# EAGLE design GamePad (EAGLE 9.3.2)
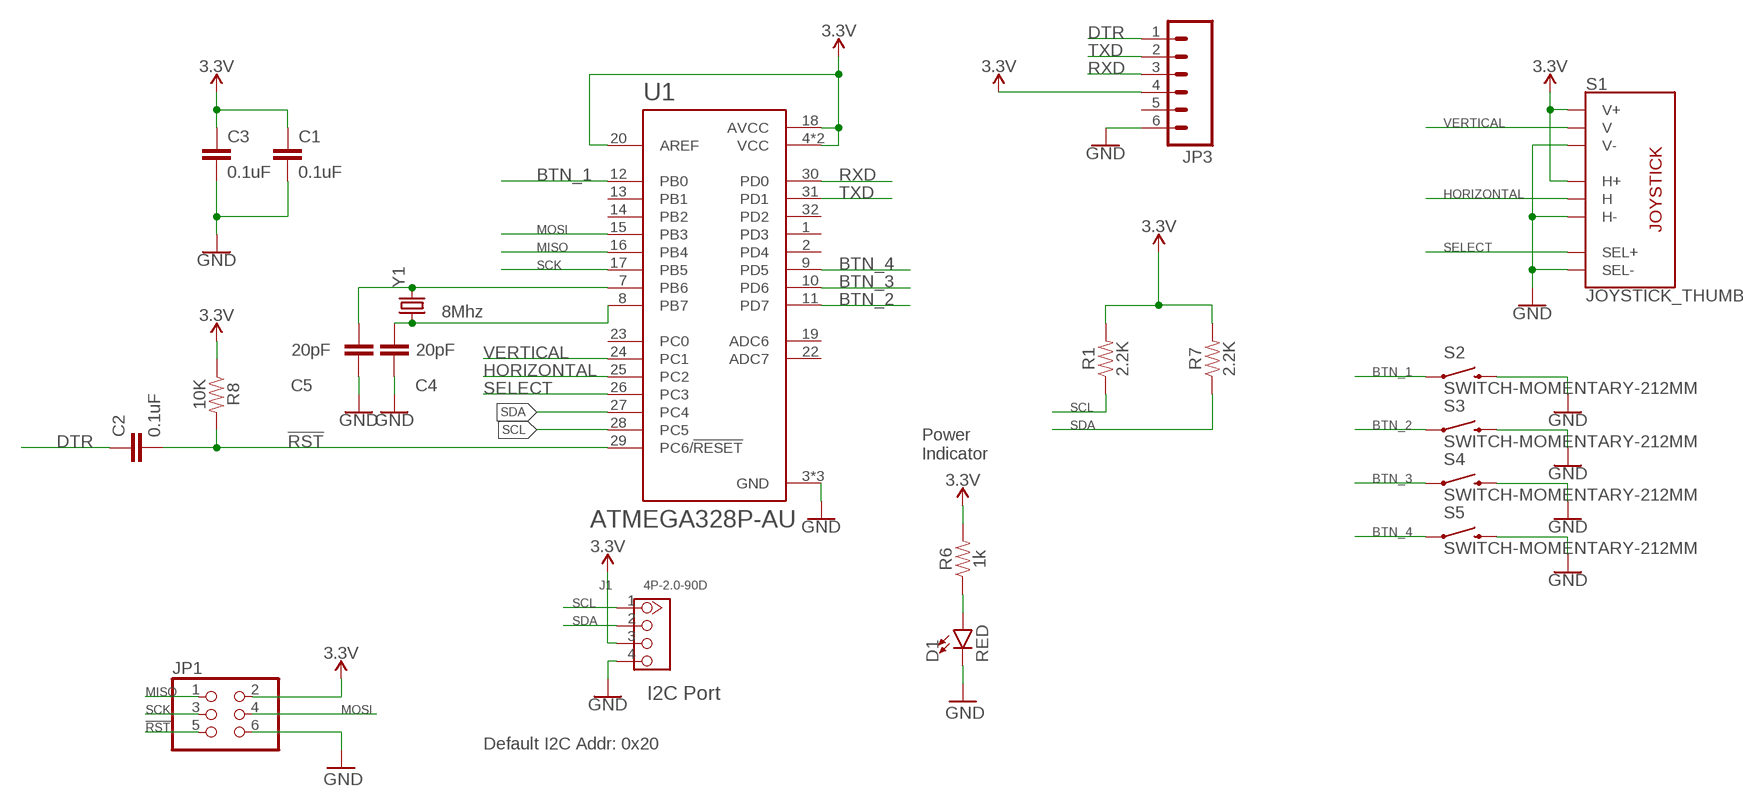
[diagram p0: schematic, sheet 1]

## Parts
C1  0.1uF  CAP0603-CAP  [0603-CAP]
C2  0.1uF  CAP0603-CAP  [0603-CAP]
C3  0.1uF  CAP0603-CAP  [0603-CAP]
C4  20pF  CAP0603-CAP  [0603-CAP]
C5  20pF  CAP0603-CAP  [0603-CAP]
D1  RED  LED-RED0603  [LED-0603]
J1  4P-2.0-90D  GROVE-CONNECTOR-DIP-90D(4P-2.0)  [HW4-2.0-90D]
JP1  PINHD-2X3  [2X03]
JP3  M06LOCK  [1X06_LOCK]
R1  2.2K  4.7KOHM-0603-1/10W-1%  [0603]
R6  1k  1KOHM-0603-1/10W-1%  [0603]
R7  2.2K  4.7KOHM-0603-1/10W-1%  [0603]
R8  10K  330OHM-0603-1/10W-1%  [0603]
S1  JOYSTICK_THUMB  [JOYSTICK]
S2  SWITCH-MOMENTARY-212MM  [TACTILE-PTH-12MM]
S3  SWITCH-MOMENTARY-212MM  [TACTILE-PTH-12MM]
S4  SWITCH-MOMENTARY-212MM  [TACTILE-PTH-12MM]
S5  SWITCH-MOMENTARY-212MM  [TACTILE-PTH-12MM]
U1  ATMEGA328P-AU  [QFP80P900X900X120-32N]
Y1  8Mhz  CRYSTALSMD  [HC49UP]

## Nets
3.3V: C1.1 C3.1 J1.3 JP1.2 JP3.4 R1.2 R6.2 R7.2 R8.1 S1.H1(H+) S1.V1(V+) U1.4(VCC) U1.6(VCC) U1.18(AVCC) U1.20(AREF)
!RST: C2.2 JP1.5 R8.2 U1.29(PC6/!RESET)
BTN_1: S2.1 U1.12(PB0)
BTN_2: S3.1 U1.11(PD7)
BTN_3: S4.1 U1.10(PD6)
BTN_4: S5.1 U1.9(PD5)
DTR: C2.1 JP3.1
GND: C1.2 C3.2 C4.1 C5.1 D1.C J1.4 JP1.6 JP3.6 S1.B2A(SEL-) S1.H3(H-) S1.V3(V-) S2.3 S3.3 S4.3 S5.3 U1.3(GND) U1.5(GND) U1.21(GND)
HORIZONTAL: S1.H2(H) U1.25(PC2)
MISO: JP1.1 U1.16(PB4)
MOSI: JP1.4 U1.15(PB3)
N$1: D1.A R6.1
N$4: C5.2 U1.7(PB6) Y1.2
N$5: C4.2 U1.8(PB7) Y1.1
RXD: JP3.3 U1.30(PD0)
SCK: JP1.3 U1.17(PB5)
SCL: J1.1 R1.1 U1.28(PC5)
SDA: J1.2 R7.1 U1.27(PC4)
SELECT: S1.B1A(SEL+) U1.26(PC3)
TXD: JP3.2 U1.31(PD1)
VERTICAL: S1.V2(V) U1.24(PC1)
Unconnected: JP3.5 U1.1(PD3) U1.2(PD4) U1.13(PB1) U1.14(PB2) U1.19(ADC6) U1.22(ADC7) U1.23(PC0) U1.32(PD2)

## Notes on the sheet
- Power
  Indicator
- I2C Port
- Default I2C Addr: 0x20

## Library data of the parts
C1-C5 = SparkFun:CAP: Capacitor Standard 0603 ceramic capacitor, and 0.1" leaded capacitor.
D1 = SparkFun-LED:LED-RED: Red SMD LED Used in manufacturing of most products at SparkFun Packages: 0603 - SMD 0603 package [Product Link] <http://docs.avagotech.com/docs/AV02-0551EN> 0603 SMART - SMD 0603 SMART package ( more efficient and expensive)[Product Link] <http://www.osram-os.com/Graphics/XPic2/00077099_0.pdf> 1206 - SMD1206 package [Product Link] <https://www.sparkfun.com/datasheets/DevTools/LilyPad/Q150OVS4.pdff> SparkFun Products: Pro Mini 328 -5V <https://www.sparkfun.com/products/821> RedBoard <https://www.sparkfun.com/products/12757> IOIO-OTG <https://www.sparkfun.com/products/13613>; PROD_ID: DIO-00819
J1 = Seeed-Connector -2016:GROVE-CONNECTOR-DIP-90D(4P-2.0): 320110034
JP1 = SparkFun:PINHD-2X3: PIN HEADER
JP3 = SparkFun:M06: Header 6 Standard 6-pin 0.1" header. Use with straight break away headers (SKU : PRT-00116), right angle break away headers (PRT-00553), swiss pins (PRT-00743), machine pins (PRT-00117), and female headers (PRT-00115). Molex polarized connector foot print use with SKU : PRT-08094 with associated crimp pins and housings. NOTES ON THE VARIANTS LOCK and LOCK_LONGPADS... This footprint was designed to help hold the alignment of a through-hole component (i.e. 6-pin header) while soldering it into place. You may notice that each hole has been shifted either up or down by 0.005 of an inch from it's more standard position (which is a perfectly straight line). This slight alteration caused the pins (the squares in the middle) to touch the edges of the holes. Because they are alternating, it causes a "brace" to hold the component in place. 0.005 has proven to be the perfect amount of "off-center" position when using our standard breakaway headers. Although looks a little odd when you look at the bare footprint, once you have a header in there, the alteration is very hard to notice. Also, if you push a header all the way into place, it is covered up entirely on the bottom side. This idea of altering the position of holes to aid alignment will be further integrated into the Sparkfun Library for other footprints. It can help hold any component with 3 or more connection pins.
R1 R7 = SparkFun-Resistors:4.7KOHM: 4.7kΩ resistor A resistor is a passive two-terminal electrical component that implements electrical resistance as a circuit element. Resistors act to reduce current flow, and, at the same time, act to lower voltage levels within circuits. - Wikipedia; PROD_ID: RES-07857; VALUE: 4.7k
R6 = SparkFun-Resistors:1KOHM: 1kΩ resistor A resistor is a passive two-terminal electrical component that implements electrical resistance as a circuit element. Resistors act to reduce current flow, and, at the same time, act to lower voltage levels within circuits. - Wikipedia; PROD_ID: RES-07856
R8 = SparkFun-Resistors:330OHM: 330Ω resistor A resistor is a passive two-terminal electrical component that implements electrical resistance as a circuit element. Resistors act to reduce current flow, and, at the same time, act to lower voltage levels within circuits. - Wikipedia; PROD_ID: RES-00818; VALUE: 330
S1 = SparkFun-Switches:JOYSTICK_THUMB: Analog Thumb Joystick This is a joystick very similar to the ‘analog’ joysticks on PS2 (PlayStation 2) controllers. Directional movements are simply two potentiometers - one for each axis. Pots are ~10k each. This joystick also has a select button that is actuated when the joystick is pressed down. SparkFun Products Thumb Joystick <https://www.sparkfun.com/products/9032> (COM-09032) SparkFun Thumb Joystick Breakout <https://www.sparkfun.com/products/9110> (BOB-09110) SparkFun Joystick Shield Kit <https://www.sparkfun.com/products/9760> (DEV-09760); PROD_ID: COMP-09744; SF_SKU: COM-09032
S2-S5 = SparkFun:SWITCH-MOMENTARY-2
U1 = ATMEGA328P-AU:ATMEGA328P-AU: ATmega Series 20 MHz 32 KB Flash 2 KB SRAM 8-Bit Microcontroller - TQFP-32; AVAILABILITY: Unavailable; DESCRIPTION: Microcontroller Mcu, 8 Bit, Atmega, 20mhz, Tqfp-32; MF: Microchip; MP: ATMEGA328P-AU; PACKAGE: TQFP-32 Microchip; PRICE: None
Y1 = SparkFun:CRYSTAL: Crystals Various standard crystals. Proven footprints. Spark Fun Electronics SKU : COM-00534

## Board
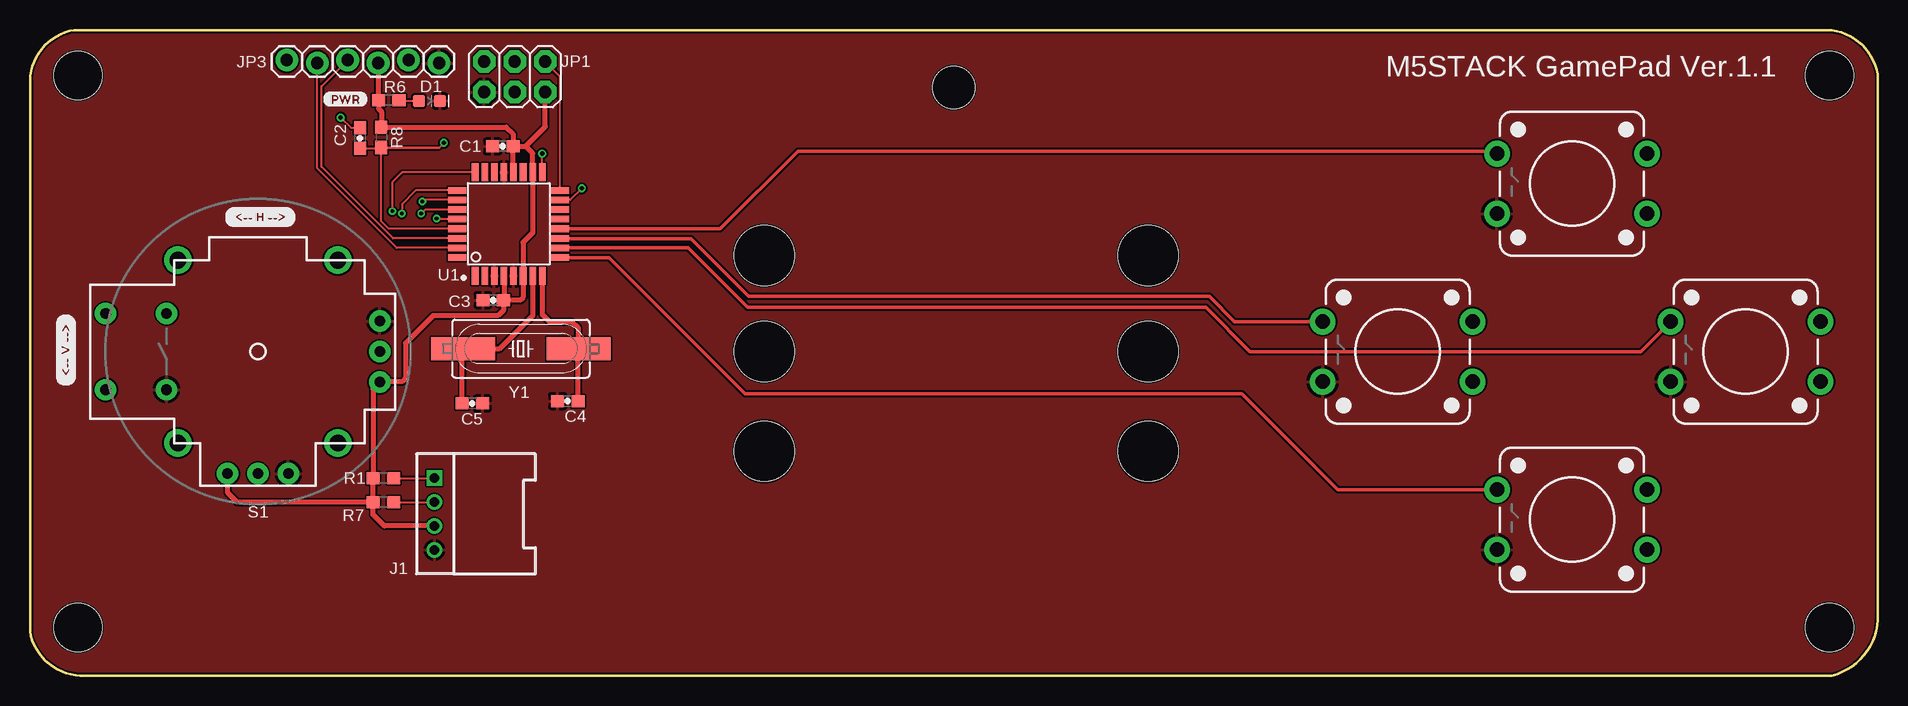
[diagram p1: board, top side]
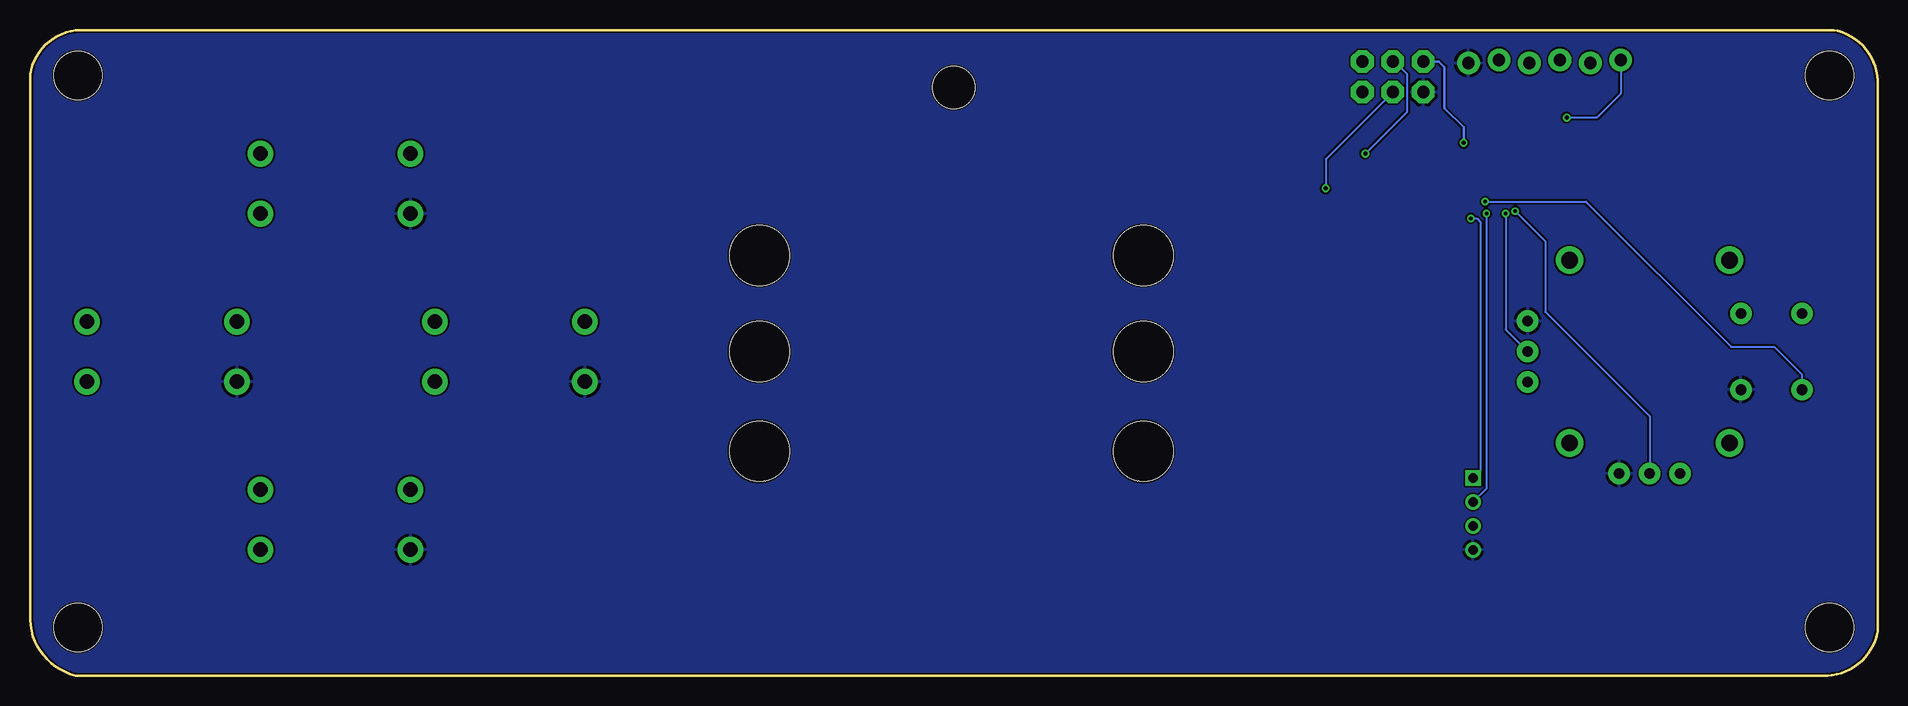
[diagram p2: board, bottom side, seen from below]

Size 154 x 53.8 mm. Coordinates in mm from the lower left corner, seen from the top.
Outline: 0,49.6 0,3.7 arc79 4.2,0 150.2,0 arc79 154,5.1 154,50.1 arc79 149.8,53.8 3.7,53.8 arc79 0,49.6
Copper layers (1*16): Top 0.035mm / dielectric 1.5mm / Bottom 0.035mm
Design rules "SparkFun-2-layer-PCBWay-LIMIT": minimum track width 6mil, minimum drill 0.3mm, track to track 6mil, track to pad 6mil, pad to pad 6mil, via to via 6mil, smd to smd 6mil, copper to edge 6mil, drill to drill 6mil, minimum pad ring 6mil, minimum via ring 6mil, stop-mask expansion 4mil, vias tented up to drill 25mil, thermal gap 10mil
Holes 5 mm at 61.2,35 61.2,27 61.2,18.7 93.2,35 93.2,27 93.2,18.7
Holes 4 mm at 4,50 4,4 150,50 150,4
Holes 3.5 mm at 77,49

### Footprints (pad centres in the part's own frame; a part is rotated, then mirrored left to right if it is on the bottom)
0603-CAP = smd 1.1 x 1: 1 -0.85,0; 2 0.85,0
LED-0603 = smd 1 x 1: A -0.877,0; C 0.877,0
HW4-2.0-90D = drill 0.8 pad 1.27 square: 1 -3,0 | drill 0.8 pad 1.27: 2 -1,0; 3 1,0; 4 3,0
2X03 = drill 1.016 pad 1.88 octagon: 1 -2.54,-1.27; 2 -2.54,1.27; 3 0,-1.27; 4 0,1.27; 5 2.54,-1.27; 6 2.54,1.27
1X06_LOCK = drill 1.016 pad 1.88: 1 0,0; 2 2.54,-0.254; 3 5.08,0; 4 7.62,-0.254; 5 10.16,0; 6 12.7,-0.254
0603 = smd 1.1 x 1: 1 -0.85,0; 2 0.85,0
JOYSTICK = drill 0.9 pad 1.778: B1A -3.175,12.7; B1B 3.175,12.7; B2A -3.175,7.62; B2B 3.175,7.62 | drill 0.889 pad 1.778: H1 -2.54,-10.16; H2 0,-10.16; H3 2.54,-10.16; V1 -10.16,2.54; V2 -10.16,0; V3 -10.16,-2.54 | drill 1.397 pad 2.286: MOUNT1 -7.62,6.668; MOUNT2 -7.62,-6.668; MOUNT3 7.62,-6.668; MOUNT4 7.62,6.668
TACTILE-PTH-12MM = drill 1.2 pad 2.159: 1 6.25,-2.5; 2 -6.25,-2.5; 3 6.25,2.5; 4 -6.25,2.5
QFP80P900X900X120-32N = smd 1.5 x 0.55: 1 -4.3,2.8; 2 -4.3,2; 3 -4.3,1.2; 4 -4.3,0.4; 5 -4.3,-0.4; 6 -4.3,-1.2; 7 -4.3,-2; 8 -4.3,-2.8; 17 4.3,-2.8; 18 4.3,-2; 19 4.3,-1.2; 20 4.3,-0.4; 21 4.3,0.4; 22 4.3,1.2; 23 4.3,2; 24 4.3,2.8 | smd 0.55 x 1.5: 9 -2.8,-4.3; 10 -2,-4.3; 11 -1.2,-4.3; 12 -0.4,-4.3; 13 0.4,-4.3; 14 1.2,-4.3; 15 2,-4.3; 16 2.8,-4.3; 25 2.8,4.3; 26 2,4.3; 27 1.2,4.3; 28 0.4,4.3; 29 -0.4,4.3; 30 -1.2,4.3; 31 -2,4.3; 32 -2.8,4.3
HC49UP = smd 5.334 x 1.93: 1 -4.826,0; 2 4.826,0

### Placement (x,y rotation side)
C1  39.41,44.11 180 top
C2  27.5,44.8 270 top
C3  38.61,31.28 180 top
C4  44.83,22.88 0 top
C5  36.87,22.68 180 top
D1  33.3,47.89 0 top
J1  33.71,13.47 270 top
JP1  40.4,49.9 180 top
JP3  21.4,51.3 0 top
R1  29.45,16.45 180 top
R6  29.9,47.95 180 top
R7  29.45,14.45 180 top
R8  29.29,44.85 270 top
S1  19,27 90 top
S2  128.54,41 180 top
S3  114,27 180 top
S4  143,27 180 top
S5  128.54,13 180 top
U1  39.9,37.64 90 top
U$7  [###_V_###0]  2.99,24.1 90 top
U$14  [PWR-()-03]  24.41,48.04 0 top
U$15  [###_H_###1]  16.21,38.21 0 top
Y1  40.91,27.24 180 top

### Tracks (layer width: path | path; a pad name or v marks a point on that pad's centre or on a via)
3.3V
  Top 0.406: JP1.2 42.94,45.74 41.31,44.11 | C3.1 40.88,31.28 41.1,31.5 U1.6 41.1,36.1 41.9,36.9 U1.18 41.9,43.52 41.31,44.11 | U1.4 39.5,31.32 C3.1 | R7.2 R1.2 28.6,23.9 S1.H1 29.2,24.5 31,24.5 31.3,24.8 31.3,27.7 33.6,30 39,30 39.46,30.46 C3.1 | R7.2 17.25,14.45 16.46,15.24 S1.V1 | J1.3 29.53,12.47 28.6,13.4 R7.2 | JP3.4 29.02,47.98 R6.2 29.05,47.25 29.3,47 R8.1 39.7,45.7 40.26,45.14 C1.1 | U1.20 40.26,41.98 C1.1 | C1.1 41.31,44.11
!RST  (via drill 0.35)
  Top 0.152: U1.29 29.89,37.24 29.27,37.87 29.27,43.98 | 29.27,43.98 R8.2 | C2.2 29.24,43.95 29.27,43.98
  Top 0.2: R8.2 34.1,44 v34.5,44.4
  Bottom 0.2: v34.5,44.4 34.5,45.7 36.1,47.3 36.1,50.7 36.57,51.17 JP1.5
BTN_1
  Top 0.305: U1.12 57.54,37.24 64,43.7 122.09,43.7 S2.1
BTN_2
  Top 0.305: S3.1 100.4,29.5 98.3,31.6 59.9,31.6 55.1,36.4 44.24,36.4 U1.11
BTN_3
  Top 0.305: U1.10 54.86,35.64 59.8,30.7 98,30.7 101.7,27 134.25,27 S4.1
BTN_4
  Top 0.305: S5.1 109,15.5 101,23.5 59.6,23.5 48.26,34.84 U1.9
DTR  (via drill 0.35)
  Top 0.152: v25.9,46.5 26.75,45.65 C2.1
  Bottom 0.152: JP3.1 21.4,48.5 23.4,46.5 v25.9,46.5
GND
  pour Top: 0,0 154,0 154,54.1 0,54.1
  pour Bottom: 0.1,-0.1 154.1,-0.1 154.1,54 0.1,54
HORIZONTAL  (via drill 0.3)
  Top 0.152: U1.25 32.14,40.44 31,39.3 v31,38.5
  Bottom 0.152: v31,38.5 31,28.84 S1.H2
MISO
  Top 0.152: U1.16 44.2,49.91 JP1.1
MOSI  (via drill 0.35)
  Top 0.152: v46,40.6 45.04,39.64 U1.15
  Bottom 0.152: JP1.4 46,43.03 v46,40.6
N$1
  Top 0.152: R6.1 30.81,47.89 D1.A
N$4
  Top 0.406: C5.2 36.02,27.18 36.04,27.2 | 36.04,27.2 Y1.2 | U1.7 41.9,30 39.1,27.2 36.04,27.2
N$5
  Top 0.406: C4.2 45.68,27.18 | 45.68,27.18 Y1.1 | U1.8 42.7,30.1 43.3,29.5 45.2,29.5 45.68,29.02 45.68,27.18
RXD
  Top 0.152: U1.30 30.26,36.44 24.3,42.4 24.3,49.12 JP3.3
SCK  (via drill 0.35)
  Top 0.152: U1.17 v42.7,43.5
  Bottom 0.152: v42.7,43.5 39.2,47 39.2,50.1 40.27,51.17 JP1.3
SCL  (via drill 0.3)
  Top 0.152: R1.1 33.69,16.45 J1.1 | U1.28 33.96,38.04 v33.9,38.1
  Bottom 0.152: v33.9,38.1 33.4,38.1 33.1,37.8 33.1,17.08 J1.1
SDA  (via drill 0.3)
  Top 0.152: R7.1 33.69,14.45 J1.2 | U1.27 32.94,38.84 v32.6,38.5
  Bottom 0.152: v32.6,38.5 32.6,15.58 J1.2
SELECT  (via drill 0.3)
  Top 0.152: U1.26 32.84,39.64 v32.7,39.5
  Bottom 0.152: v32.7,39.5 24.3,39.5 12.2,27.4 8.6,27.4 6.3,25.1 S1.B1A
TXD
  Top 0.152: U1.31 30.56,35.64 23.94,42.26 JP3.2
VERTICAL  (via drill 0.3)
  Top 0.152: U1.24 31.04,41.94 30.2,41.1 v30.2,38.7
  Bottom 0.152: v30.2,38.7 27.7,36.2 27.7,30.3 19,21.6 S1.V2

### Text on the board
tNames: M5STACK GamePad Ver.1.1